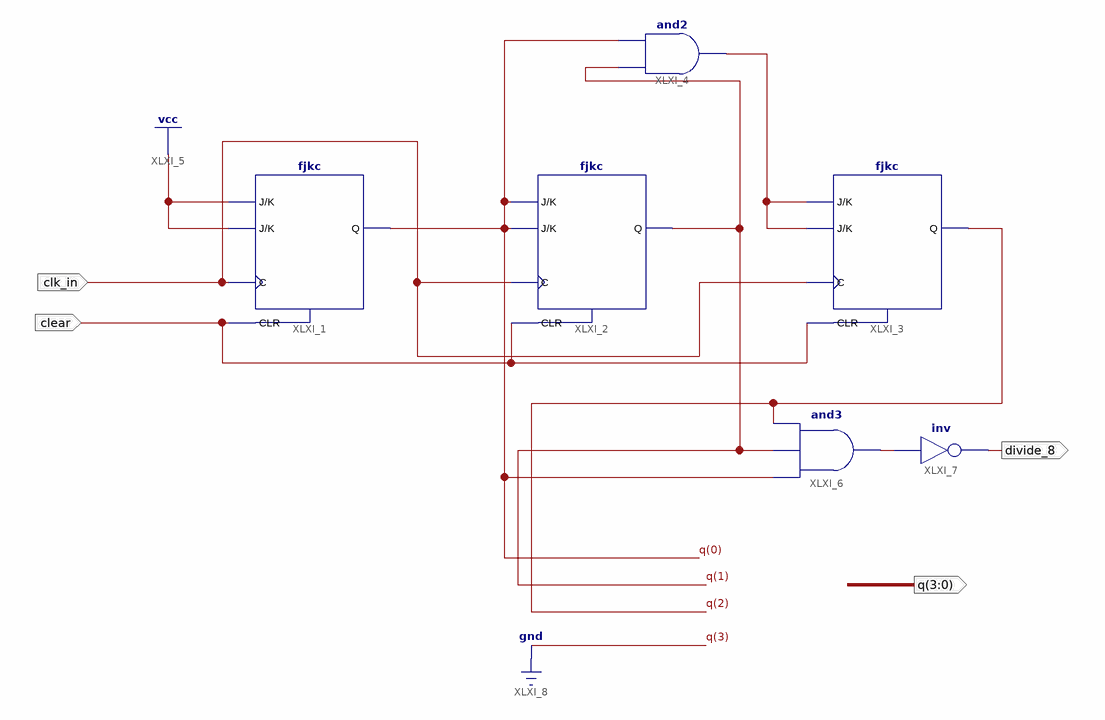
[diagram p0: schematic sheet 1]
// Xilinx ISE schematic counter07.sch (spartan6) as structural Verilog: 6 symbols, 4 ports
module counter07 (
  input  clk_in,
  input  clear,
  output [3:0] q,
  output divide_8
);

  wire XLXN_4, XLXN_10;

  fjkc XLXI_1 (.C(clk_in), .CLR(clear), .J(1'b1), .K(1'b1), .Q(q[0]));
  fjkc XLXI_2 (.C(clk_in), .CLR(clear), .J(q[0]), .K(q[0]), .Q(q[1]));
  fjkc XLXI_3 (.C(clk_in), .CLR(clear), .J(XLXN_4), .K(XLXN_4), .Q(q[2]));
  and XLXI_4 (XLXN_4, q[1], q[0]);
  and XLXI_6 (XLXN_10, q[0], q[1], q[2]);
  not XLXI_7 (divide_8, XLXN_10);

  assign q[3] = 1'b0;
endmodule
